# Altium schematic sheet badge4.SchDoc
size Letter
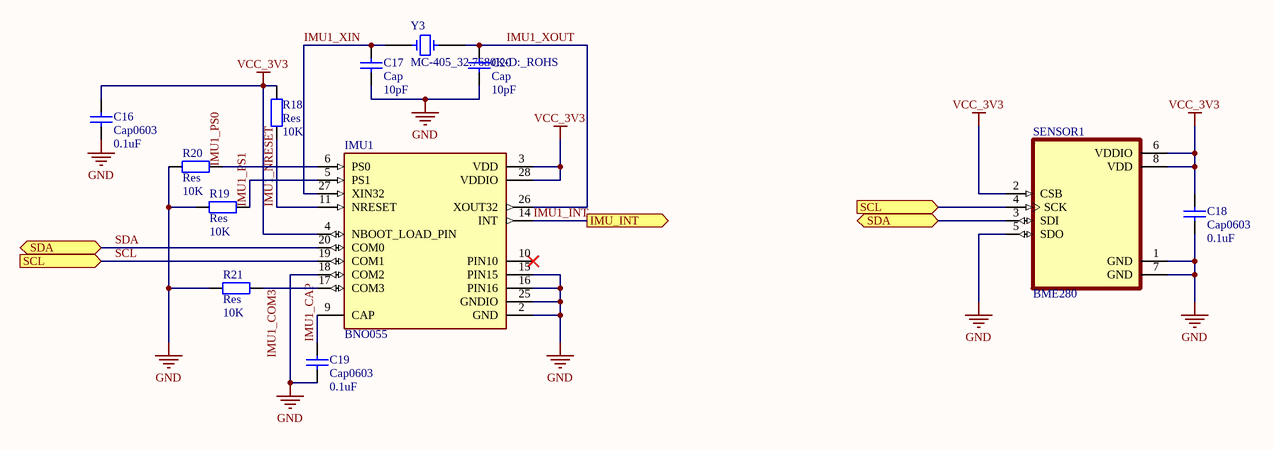
[diagram p0: badge4.SchDoc]

## Parts
C16  Cap0603  value 0.1uF  [C0603]
C17  Cap  value 10pF  [C0603]
C18  Cap0603  value 0.1uF  [C0603]
C19  Cap0603  value 0.1uF  [C0603]
C20  Cap  value 10pF  [C0603]
IMU1  BNO055  [LGA28R50P4X10_380X520X100]
R18  Res  value 10K  [R0603]
R19  Res  value 10K  [R0603]
R20  Res  value 10K  [R0603]
R21  Res  value 10K  [R0603]
SENSOR1  BME280  [PSON65P250X250X100-8N]
Y3  MC-405_32.7680K-D:_ROHS  [XTAL320X150]

## Ports
IMU_INT (out), SCL (in), SDA (bidir)

## Nets
GND: C16.1 C17.1 C18.1 C19.1 C20.1 IMU1.2(GND) IMU1.15(PIN15) IMU1.16(PIN16) IMU1.18(COM2) IMU1.25(GNDIO) R19.1 R20.1 R21.1 SENSOR1.1(GND) SENSOR1.5(SDO) SENSOR1.7(GND)
VCC_3V3: C16.2 C18.2 IMU1.3(VDD) IMU1.4(NBOOT_LOAD_PIN) IMU1.28(VDDIO) R18.2 SENSOR1.2(CSB) SENSOR1.6(VDDIO) SENSOR1.8(VDD)
IMU1_CAP: C19.2 IMU1.9(CAP)
IMU1_COM3: IMU1.17(COM3) R21.2
IMU1_INT: IMU1.14(INT) ; port IMU_INT
IMU1_NRESET: IMU1.11(NRESET) R18.1
IMU1_PS0: IMU1.6(PS0) R20.2
IMU1_PS1: IMU1.5(PS1) R19.2
IMU1_XIN: C17.2 IMU1.27(XIN32) Y3.2
IMU1_XOUT: C20.2 IMU1.26(XOUT32) Y3.1
SCL: IMU1.19(COM1) SENSOR1.4(SCK) ; port SCL
SDA: IMU1.20(COM0) SENSOR1.3(SDI) ; port SDA

Not connected (* = marked no-connect by the designer): IMU1 10(PIN10)*

## Library data of the parts
C16 C18 C19 = Cap0603: Capacitor; MF: KEMET; MP: C0603C104Z3VACTU; Published: 8-Jun-2000; LatestRevisionDate: 17-Jul-2002; LatestRevisionNote: Re-released for DXP Platform.; PackageReference: 0603; Publisher: Altium Limited; PackageDescription: SMD Capacitor
C17 C20 = Cap: Capacitor; MF: KEMET; MP: C0603C100J1GACTU; Published: 8-Jun-2000; LatestRevisionDate: 17-Jul-2002; LatestRevisionNote: Re-released for DXP Platform.; PackageReference: RAD-0.3; Publisher: Altium Limited; PackageDescription: SMD Capacitor
IMU1 = BNO055: Accelerometer, Gyroscope, Magnetometer, 9 Axis Sensor IÂ²C, UART Output; MF: Bosch; Digi-Key_Purchase_URL: https://www.digikey.com/product-detail/en/bosch-sensortec/BNO055/828-1058-1-ND/6136309?utm_source=snapeda&utm_medium=aggregator&utm_campaign=symbol; Value: *; Package: LGA-28 Bosch; MP: BNO055; SnapEDA_Link: https://www.snapeda.com/parts/BNO055/Bosch%20Sensortec/view-part/51961/?ref=snap; Digi-Key_Part_Number: 828-1058-1-ND
R18-R21 = Res: Resistor; MF: Yageo; MP: RC0603JR-0710KL; Published: 8-Jun-2000; LatestRevisionDate: 17-Jul-2002; LatestRevisionNote: Re-released for DXP Platform.; PackageReference: AXIAL-0.4; Publisher: Altium Limited; PackageDescription: SMD Resistor
SENSOR1 = BME280: Humidity Temperature Sensor 0 ~ 100% RH IÂ²C, SPI Â±3% 1s Surface Mount; MF: Bosch; Price: None; Package: LGA-8 Bosch; Value: *; MP: BME280; Availability: Unavailable; SnapEDA_Link: https://www.snapeda.com/parts/BME280/Bosch%20Sensortec/view-part/49769/?ref=snap
Y3 = MC-405_32.7680K-D:_ROHS: 32.768kHz Â±20ppm Crystal 35 kOhms 4-SOJ, 2.29mm pitch; MP: DNP; SnapEDA_Link: https://www.snapeda.com/parts/MC-405%2032.7680K-D:%20ROHS/EPSON/view-part/3612388/?ref=snap; Value: *; Package: 4-4 EPSON; MF: DNP; Price: None; Availability: Unavailable